# Altium schematic sheet w47_LED_RGB_pinout.SchDoc
size A3
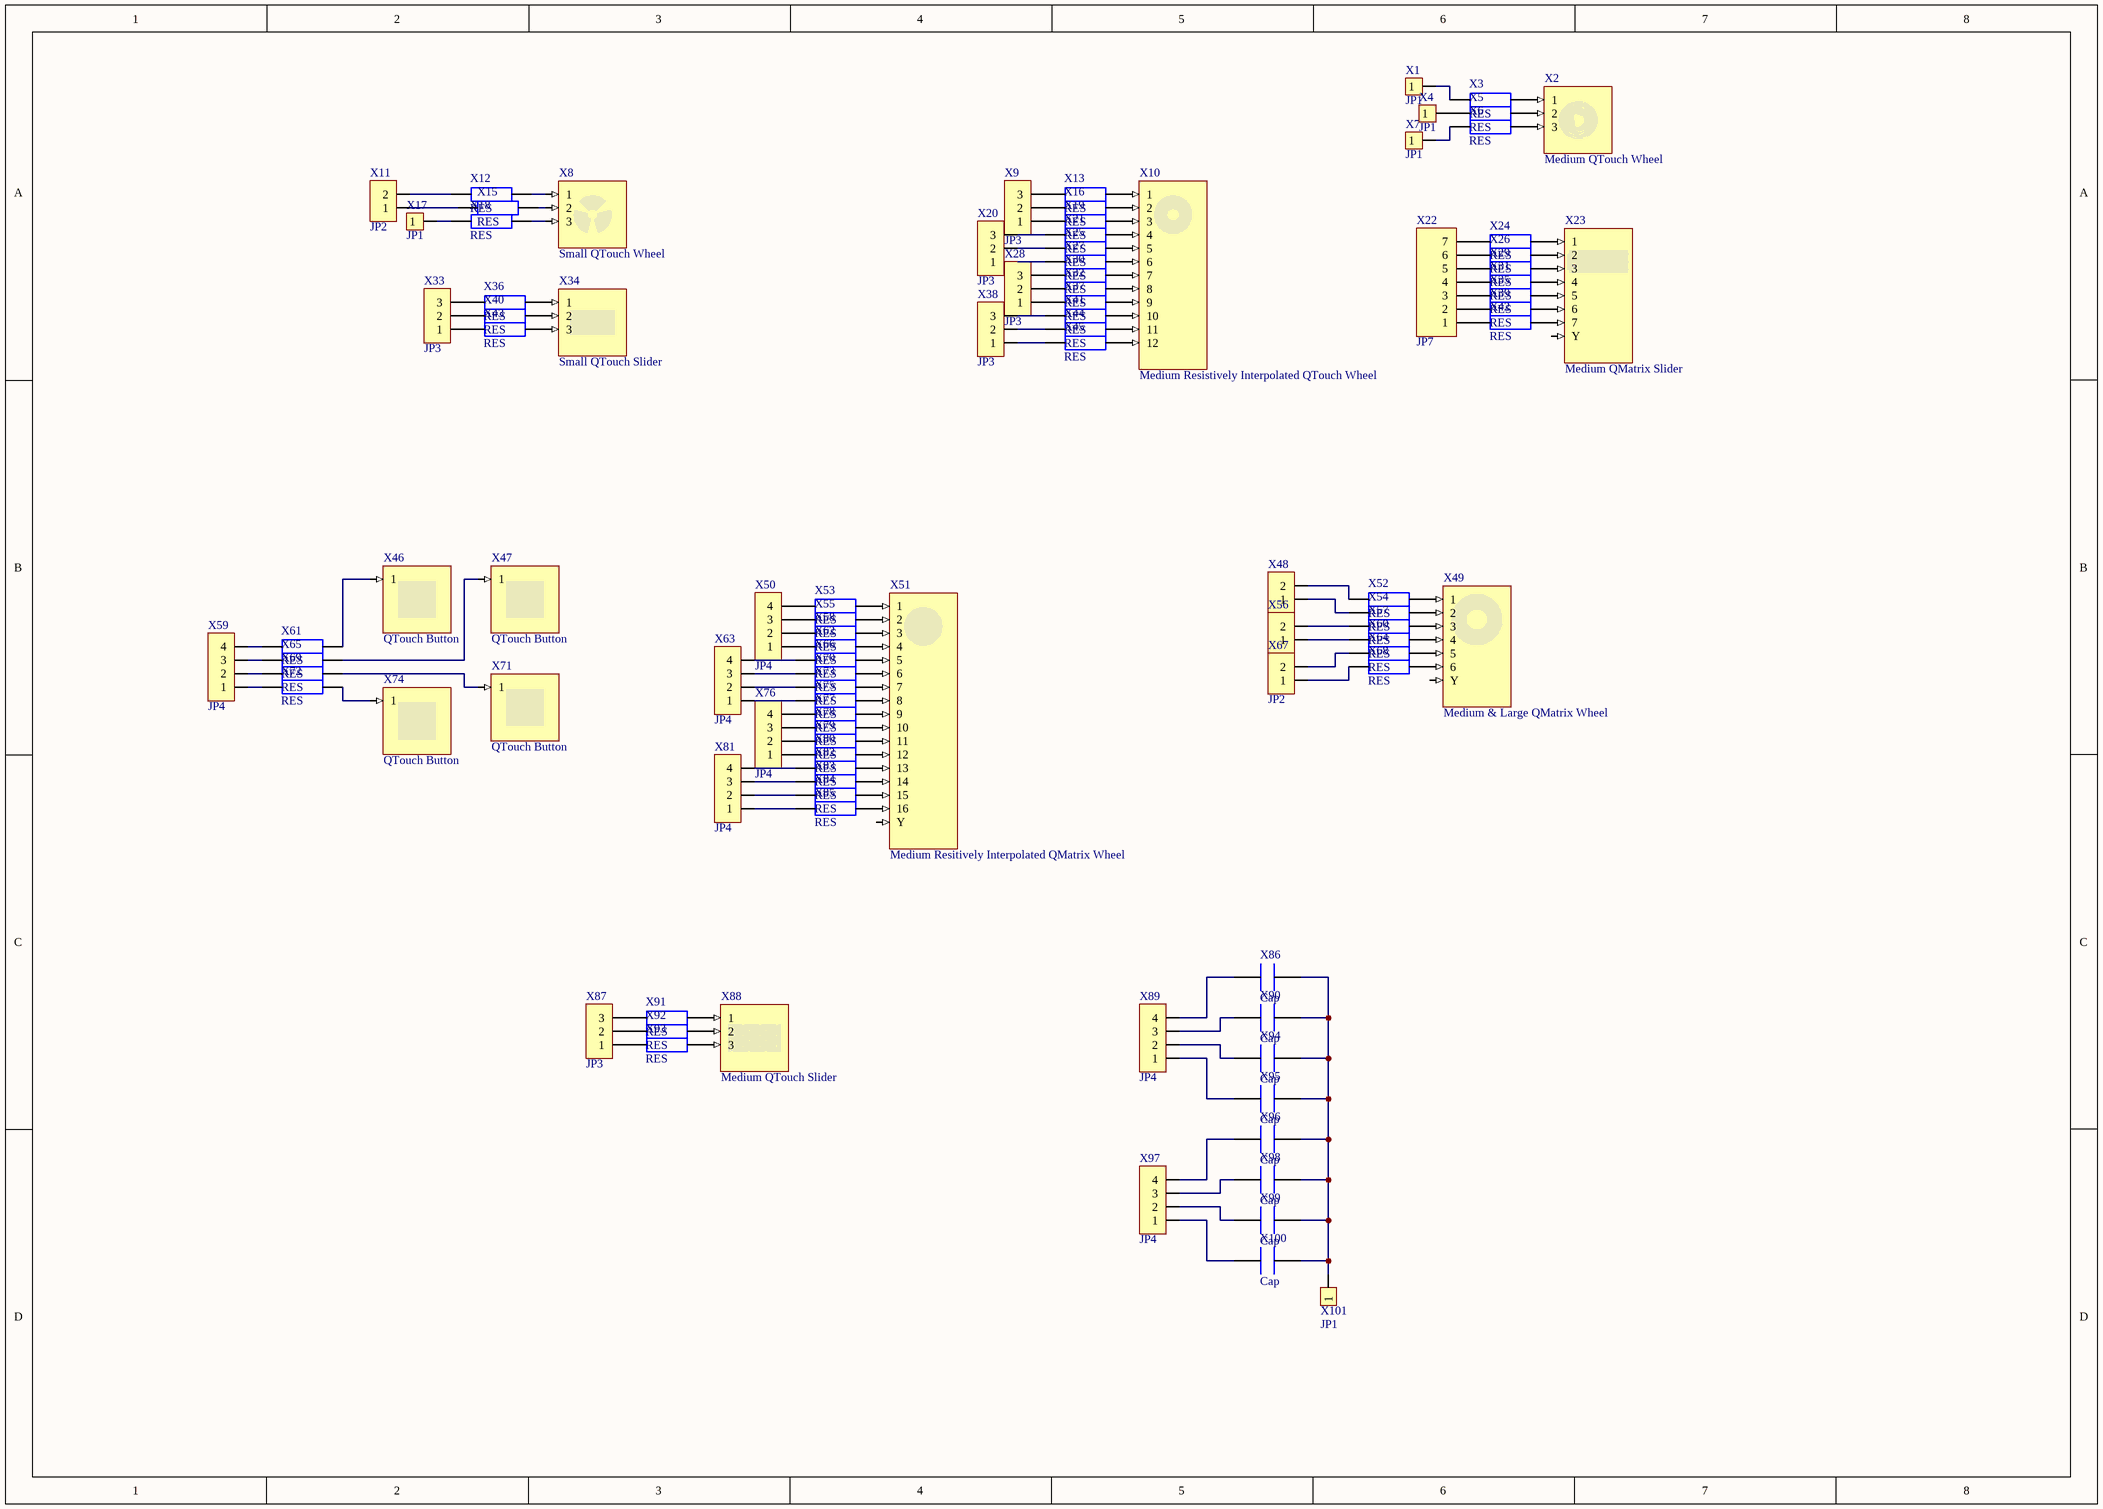
[diagram p0: w47_LED_RGB_pinout.SchDoc]

## Parts
X1  JP1  [JP1-D1T]
X2  Medium QTouch Wheel  (no BOM)
X3  RES  [RES]
X4  JP1  [JP1-D1T]
X5  RES  [RES]
X6  RES  [RES]
X7  JP1  [JP1-D1T]
X8  Small QTouch Wheel  (no BOM)
X9  JP3  [JP3-C1T]
X10  Medium Resistively Interpolated QTouch Wheel  (no BOM)
X11  JP2  [JP2-C1T]
X12  RES  [RES]
X13  RES  [RES]
X15  RES  [RES]
X16  RES  [RES]
X17  JP1  [JP1-D1T]
X18  RES  [RES]
X19  RES  [RES]
X20  JP3  [JP3-C1T]
X21  RES  [RES]
X22  JP7  [JP7-D1T]
X23  Medium QMatrix Slider  (no BOM)
X24  RES  [RES]
X25  RES  [RES]
X26  RES  [RES]
X27  RES  [RES]
X28  JP3  [JP3-C1T]
X29  RES  [RES]
X30  RES  [RES]
X31  RES  [RES]
X32  RES  [RES]
X33  JP3  [JP3-C1T]
X34  Small QTouch Slider  (no BOM)
X35  RES  [RES]
X36  RES  [RES]
X37  RES  [RES]
X38  JP3  [JP3-C1T]
X39  RES  [RES]
X40  RES  [RES]
X41  RES  [RES]
X42  RES  [RES]
X43  RES  [RES]
X44  RES  [RES]
X45  RES  [RES]
X46  QTouch Button  (no BOM)
X47  QTouch Button  (no BOM)
X48  JP2  [JP2-C1T]
X49  Medium & Large QMatrix Wheel
X50  JP4  [JP4-C1T]
X51  Medium Resitively Interpolated QMatrix Wheel  (no BOM)
X52  RES  [RES]
X53  RES  [RES]
X54  RES  [RES]
X55  RES  [RES]
X56  JP2  [JP2-C1T]
X57  RES  [RES]
X58  RES  [RES]
X59  JP4  [JP4-C1T]
X60  RES  [RES]
X61  RES  [RES]
X62  RES  [RES]
X63  JP4  [JP4-C1T]
X64  RES  [RES]
X65  RES  [RES]
X66  RES  [RES]
X67  JP2  [JP2-C1T]
X68  RES  [RES]
X69  RES  [RES]
X70  RES  [RES]
X71  QTouch Button  (no BOM)
X72  RES  [RES]
X73  RES  [RES]
X74  QTouch Button  (no BOM)
X75  RES  [RES]
X76  JP4  [JP4-C1T]
X77  RES  [RES]
X78  RES  [RES]
X79  RES  [RES]
X80  RES  [RES]
X81  JP4  [JP4-C1T]
X82  RES  [RES]
X83  RES  [RES]
X84  RES  [RES]
X85  RES  [RES]
X86  Cap  [CAP_2]
X87  JP3  [JP3-C1T]
X88  Medium QTouch Slider  (no BOM)
X89  JP4  [JP4-C1T]
X90  Cap  [CAP_2]
X91  RES  [RES]
X92  RES  [RES]
X93  RES  [RES]
X94  Cap  [CAP_2]
X95  Cap  [CAP_2]
X96  Cap  [CAP_2]
X97  JP4  [JP4-C1T]
X98  Cap  [CAP_2]
X99  Cap  [CAP_2]
X100  Cap  [CAP_2]
X101  JP1  [JP1-D1T]

## Nets
NetX1_1: X1.1 X3.1
NetX2_1: X2.1 X3.2
NetX2_2: X2.2 X5.2
NetX2_3: X2.3 X6.2
NetX4_1: X4.1 X5.1
NetX6_1: X6.1 X7.1
NetX8_1: X8.1 X12.2
NetX8_2: X8.2 X15.2
NetX8_3: X8.3 X18.2
NetX9_1: X9.1 X19.1
NetX9_2: X9.2 X16.1
NetX9_3: X9.3 X13.1
NetX10_1: X10.1 X13.2
NetX10_2: X10.2 X16.2
NetX10_3: X10.3 X19.2
NetX10_4: X10.4 X21.2
NetX10_5: X10.5 X25.2
NetX10_6: X10.6 X27.2
NetX10_7: X10.7 X30.2
NetX10_8: X10.8 X32.2
NetX10_9: X10.9 X37.2
NetX10_10: X10.10 X41.2
NetX10_11: X10.11 X44.2
NetX10_12: X10.12 X45.2
NetX11_1: X11.1 X15.1
NetX11_2: X11.2 X12.1
NetX17_1: X17.1 X18.1
NetX20_1: X20.1 X27.1
NetX20_2: X20.2 X25.1
NetX20_3: X20.3 X21.1
NetX22_1: X22.1 X42.1
NetX22_2: X22.2 X39.1
NetX22_3: X22.3 X35.1
NetX22_4: X22.4 X31.1
NetX22_5: X22.5 X29.1
NetX22_6: X22.6 X26.1
NetX22_7: X22.7 X24.1
NetX23_1: X23.1 X24.2
NetX23_2: X23.2 X26.2
NetX23_3: X23.3 X29.2
NetX23_4: X23.4 X31.2
NetX23_5: X23.5 X35.2
NetX23_6: X23.6 X39.2
NetX23_7: X23.7 X42.2
NetX28_1: X28.1 X37.1
NetX28_2: X28.2 X32.1
NetX28_3: X28.3 X30.1
NetX33_1: X33.1 X43.1
NetX33_2: X33.2 X40.1
NetX33_3: X33.3 X36.1
NetX34_1: X34.1 X36.2
NetX34_2: X34.2 X40.2
NetX34_3: X34.3 X43.2
NetX38_1: X38.1 X45.1
NetX38_2: X38.2 X44.1
NetX38_3: X38.3 X41.1
NetX46_1: X46.1 X61.2
NetX47_1: X47.1 X65.2
NetX48_1: X48.1 X54.1
NetX48_2: X48.2 X52.1
NetX49_1: X49.1 X52.2
NetX49_2: X49.2 X54.2
NetX49_3: X49.3 X57.2
NetX49_4: X49.4 X60.2
NetX49_5: X49.5 X64.2
NetX49_6: X49.6 X68.2
NetX50_1: X50.1 X62.1
NetX50_2: X50.2 X58.1
NetX50_3: X50.3 X55.1
NetX50_4: X50.4 X53.1
NetX51_1: X51.1 X53.2
NetX51_2: X51.2 X55.2
NetX51_3: X51.3 X58.2
NetX51_4: X51.4 X62.2
NetX51_5: X51.5 X66.2
NetX51_6: X51.6 X70.2
NetX51_7: X51.7 X73.2
NetX51_8: X51.8 X75.2
NetX51_9: X51.9 X77.2
NetX51_10: X51.10 X78.2
NetX51_11: X51.11 X79.2
NetX51_12: X51.12 X80.2
NetX51_13: X51.13 X82.2
NetX51_14: X51.14 X83.2
NetX51_15: X51.15 X84.2
NetX51_16: X51.16 X85.2
NetX56_1: X56.1 X60.1
NetX56_2: X56.2 X57.1
NetX59_1: X59.1 X72.1
NetX59_2: X59.2 X69.1
NetX59_3: X59.3 X65.1
NetX59_4: X59.4 X61.1
NetX63_1: X63.1 X75.1
NetX63_2: X63.2 X73.1
NetX63_3: X63.3 X70.1
NetX63_4: X63.4 X66.1
NetX64_1: X64.1 X67.2
NetX67_1: X67.1 X68.1
NetX69_2: X69.2 X71.1
NetX72_2: X72.2 X74.1
NetX76_1: X76.1 X80.1
NetX76_2: X76.2 X79.1
NetX76_3: X76.3 X78.1
NetX76_4: X76.4 X77.1
NetX81_1: X81.1 X85.1
NetX81_2: X81.2 X84.1
NetX81_3: X81.3 X83.1
NetX81_4: X81.4 X82.1
NetX86_1: X86.1 X89.4
NetX86_2: X86.2 X90.2 X94.2 X95.2 X96.2 X98.2 X99.2 X100.2 X101.1
NetX87_1: X87.1 X93.1
NetX87_2: X87.2 X92.1
NetX87_3: X87.3 X91.1
NetX88_1: X88.1 X91.2
NetX88_2: X88.2 X92.2
NetX88_3: X88.3 X93.2
NetX89_1: X89.1 X95.1
NetX89_2: X89.2 X94.1
NetX89_3: X89.3 X90.1
NetX96_1: X96.1 X97.4
NetX97_1: X97.1 X100.1
NetX97_2: X97.2 X99.1
NetX97_3: X97.3 X98.1

Not connected (* = marked no-connect by the designer): X23 Y; X49 Y; X51 Y

## Library data of the parts
X1 X4 X7 X17 X101 = JP1: WR-PHD 2.54 mm Angled Socket Header; Manufacturer: W¨¹rth Elektronik eiSos GmbH; partNo: 613002143121; ComponentLink1 Description: Manufacturer; ComponentLink2 Description: Datasheet; NoPins: 02; Created Date: 29 March 2013; ComponentLink1URL: http://www.we-online.com; ComponentLink2URL: http://katalog.we-online.de/em/datasheet/6130xx143121.pdf; Created by: Karrer Zheng
X2 = MediumQTouchWheel: ConfiguratorName: ATMEL_TOUCH; ConfigurationParameters: {}__sensorid[8]{}odiameter[30]{}idiameter[10]{}gapthickness[0.3]{}
X3 X5 X6 X12 X13 X15 X16 X18 X19 X21 X24-X27 X29-X32 X35-X37 X39-X45 X52-X55 X57 X58 X60-X62 X64-X66 X68-X70 X72 X73 X75 X77-X80 X82-X85 X91-X93 = RES: điện trở size nhỏ
X8 = SmallQTouchWheel: ConfiguratorName: ATMEL_TOUCH; ConfigurationParameters: {}__sensorid[7]{}diameter[20]{}
X9 X20 X28 X33 X38 X87 = JP3: WR-PHD 2.54 mm Angled Socket Header; Manufacturer: W¨¹rth Elektronik eiSos GmbH; partNo: 613003143121; ComponentLink1 Description: Manufacturer; ComponentLink2 Description: Datasheet; NoPins: 03; Created Date: 29 March 2013; ComponentLink1URL: http://www.we-online.com; ComponentLink2URL: http://katalog.we-online.de/em/datasheet/6130xx143121.pdf; Created by: Karrer Zheng
X10 = MediumResQTouchWheel: ConfiguratorName: ATMEL_TOUCH; ConfigurationParameters: {}__sensorid[9]{}odiameter[30]{}idiameter[9]{}segmentsbetweenchannels[3]{}gapthickness[0.3]{}
X11 X48 X56 X67 = JP2: WR-PHD 2.54 mm Angled Socket Header; Manufacturer: W¨¹rth Elektronik eiSos GmbH; partNo: 613002143121; ComponentLink1 Description: Manufacturer; ComponentLink2 Description: Datasheet; NoPins: 02; Created Date: 29 March 2013; ComponentLink1URL: http://www.we-online.com; ComponentLink2URL: http://katalog.we-online.de/em/datasheet/6130xx143121.pdf; Created by: Karrer Zheng
X22 = JP7: WR-PHD 2.54 mm Angled Socket Header; Manufacturer: W¨¹rth Elektronik eiSos GmbH; partNo: 613007143121; ComponentLink1 Description: Manufacturer; ComponentLink2 Description: Datasheet; NoPins: 07; Created Date: 29 March 2013; ComponentLink1URL: http://www.we-online.com; ComponentLink2URL: http://katalog.we-online.de/em/datasheet/6130xx143121.pdf; Created by: Karrer Zheng
X23 = MediumQMatrixSlider: ConfiguratorName: ATMEL_TOUCH; ConfigurationParameters: {}__sensorid[6]{}width[50]{}height[12]{}gapthickness[0.3]{}numchannels[4]{}segmentsbetweenchannels[1]{}ywidth[0.3]{}
X34 = SmallQTouchSlider: ConfiguratorName: ATMEL_TOUCH; ConfigurationParameters: {}__sensorid[3]{}width[25]{}height[12]{}gapthickness[0.3]{}
X46 X47 X71 X74 = QTouchButton: ConfiguratorName: ATMEL_TOUCH; ConfigurationParameters: {}__sensorid[1]{}width[15]{}height[15]{}
X49 = MediumLargeQMatrixWheel: ConfiguratorName: ATMEL_TOUCH; ConfigurationParameters: {}__sensorid[12]{}odiameter[40]{}idiameter[16]{}channels[6]{}segmentsbetweenchannels[0]{}gapthickness[0.3]{}ywidth[0.3]{}
X50 X59 X63 X76 X81 X89 X97 = JP4: WR-PHD 2.54 mm Angled Socket Header; Manufacturer: W¨¹rth Elektronik eiSos GmbH; partNo: 613004143121; ComponentLink1 Description: Manufacturer; ComponentLink2 Description: Datasheet; NoPins: 04; Created Date: 29 March 2013; ComponentLink1URL: http://www.we-online.com; ComponentLink2URL: http://katalog.we-online.de/em/datasheet/6130xx143121.pdf; Created by: Karrer Zheng
X51 = MediumResQMatrixWheel: ConfiguratorName: ATMEL_TOUCH; ConfigurationParameters: {}__sensorid[11]{}odiameter[30]{}idiameter[7.5]{}numberofkeys[4]{}segmentsbetweenchannels[3]{}gapthickness[0.3]{}ywidth[0.3]{}
X88 = MediumQTouchSlider: ConfiguratorName: ATMEL_TOUCH; ConfigurationParameters: {}__sensorid[4]{}width[50]{}height[12]{}gapthickness[0.3]{}